# Altium schematic sheet fpga_config.SchDoc
size A4
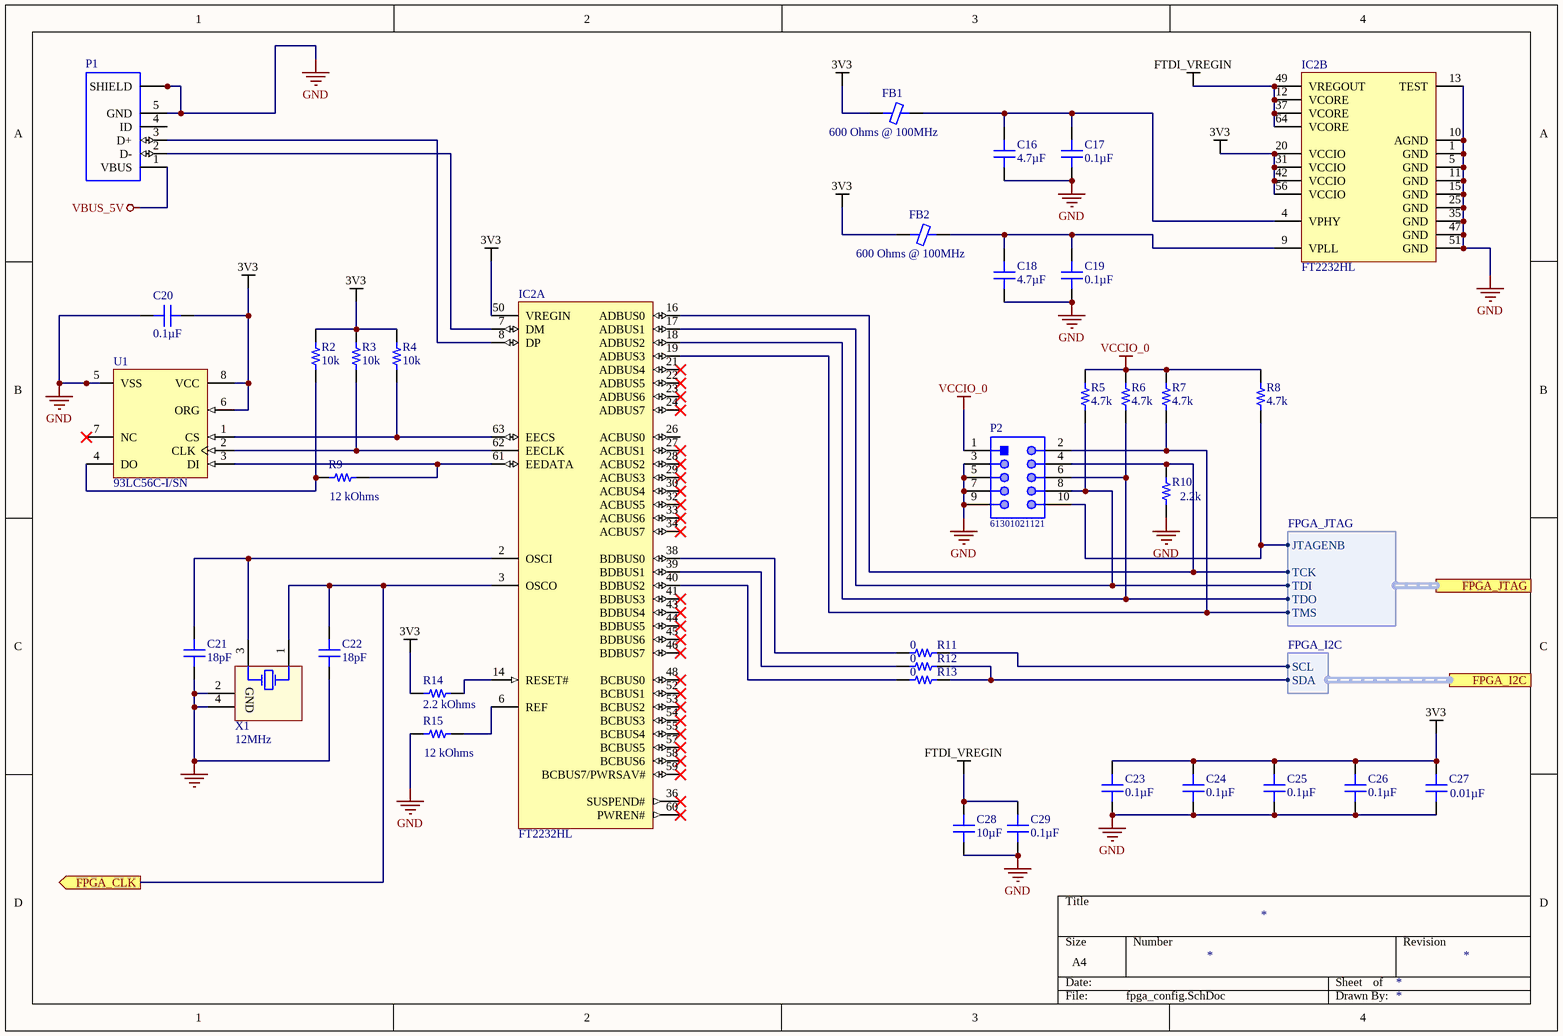
[diagram p0: fpga_config.SchDoc]

## Parts
C16  4.7µF  [CAP 0603_1608]
C17  0.1µF  [CAP 0603_1608]
C18  4.7µF  [CAP 0603_1608]
C19  0.1µF  [CAP 0603_1608]
C20  0.1µF  [CAP 0603_1608]
C21  18pF  [CAP 0603_1608]
C22  18pF  [CAP 0603_1608]
C23  0.1µF  [CAP 0603_1608]
C24  0.1µF  [CAP 0603_1608]
C25  0.1µF  [CAP 0603_1608]
C26  0.1µF  [CAP 0603_1608]
C27  0.01µF  [CAP 0603_1608]
C28  10µF  [CAP 0603_1608]
C29  0.1µF  [CAP 0603_1608]
FB1  600 Ohms @ 100MHz  [FER 0603_1608]
FB2  600 Ohms @ 100MHz  [FER 0603_1608]
IC2  FT2232HL  [FTDI-LQFP-64_L]  (parts A,B of 2)
P1  47346-0001  [MOLEX_47346-0001]  (value not drawn)
P2  61301021121  [61301021121]
R2  10k  [RES 0603_1608]
R3  10k  [RES 0603_1608]
R4  10k  [RES 0603_1608]
R5  4.7k  [RES 0603_1608]
R6  4.7k  [RES 0603_1608]
R7  4.7k  [RES 0603_1608]
R8  4.7k  [RES 0603_1608]
R9  12 kOhms  [RES 0603_1608]
R10  2.2k  [RES 0603_1608]
R11  0  [RES 0603_1608]
R12  0  [RES 0603_1608]
R13  0  [RES 0603_1608]
R14  2.2 kOhms  [RES 0603_1608]
R15  12 kOhms  [RES 0603_1608]
U1  93LC56C-I/SN  [SOIC-SN8_L]
X1  12MHz  [ABRA-ABMM2-4_V]

## Ports
FPGA_CLK (out), FPGA_I2C (harness FPGA_I2C), FPGA_JTAG (harness FPGA_JTAG)

## Harnesses
FPGA_JTAG: JTAGENB, TCK, TDI, TDO, TMS
FPGA_I2C: SCL, SDA

## Nets
3V3: C20.1 C23.2 C24.2 C25.2 C26.2 C27.2 FB1.1 FB2.1 IC2.20(VCCIO) IC2.31(VCCIO) IC2.42(VCCIO) IC2.50(VREGIN) IC2.56(VCCIO) R2.2 R3.2 R4.2 R14.1 U1.6(ORG) U1.8(VCC)
FTDI_VREGIN: C28.2 C29.2 IC2.12(VCORE) IC2.37(VCORE) IC2.49(VREGOUT) IC2.64(VCORE)
GND: C16.1 C17.1 C18.1 C19.1 C20.2 C21.1 C22.1 C23.1 C24.1 C25.1 C26.1 C27.1 C28.1 C29.1 IC2.1(GND) IC2.5(GND) IC2.10(AGND) IC2.11(GND) IC2.13(TEST) IC2.15(GND) IC2.25(GND) IC2.35(GND) IC2.47(GND) IC2.51(GND) P1.5(GND) P1.SH1(SHIELD) P1.SH2(SHIELD) P1.SH3(SHIELD) P1.SH4(SHIELD) P1.SH5(SHIELD) P1.SH6(SHIELD) P2.3 P2.5 P2.7 P2.9 R10.1 R15.1 U1.5(VSS) X1.2(GND) X1.4(GND)
VBUS_5V: P1.1(VBUS)
VCCIO_0: P2.1 R5.2 R6.2 R7.2 R8.2
FPGA_CLK: C22.2 IC2.3(OSCO) X1.1(X1) ; port FPGA_CLK
NetC16_2: C16.2 C17.2 FB1.2 IC2.4(VPHY)
NetC18_2: C18.2 C19.2 FB2.2 IC2.9(VPLL)
NetC21_2: C21.2 IC2.2(OSCI) X1.3(X2)
NetIC2_6: IC2.6(REF) R15.2
NetIC2_7: IC2.7(DM) P1.2(D-)
NetIC2_8: IC2.8(DP) P1.3(D+)
NetIC2_14: IC2.14(RESET#) R14.2
NetIC2_16: IC2.16(ADBUS0) P2.4 R10.2 ; port FPGA_JTAG.TCK
NetIC2_17: IC2.17(ADBUS1) P2.8 R5.1 ; port FPGA_JTAG.TDI
NetIC2_18: IC2.18(ADBUS2) P2.6 R6.1 ; port FPGA_JTAG.TDO
NetIC2_19: IC2.19(ADBUS3) P2.2 R7.1 ; port FPGA_JTAG.TMS
NetIC2_38: IC2.38(BDBUS0) R11.1
NetIC2_39: IC2.39(BDBUS1) R12.1
NetIC2_40: IC2.40(BDBUS2) R13.1
NetIC2_61: IC2.61(EEDATA) R9.2 U1.3(DI)
NetIC2_62: IC2.62(EECLK) R3.1 U1.2(CLK)
NetIC2_63: IC2.63(EECS) R4.1 U1.1(CS)
NetP2_10: P2.10 R8.1 ; port FPGA_JTAG.JTAGENB
NetR2_1: R2.1 R9.1 U1.4(DO)
NetR11_2: R11.2 ; port FPGA_I2C.SCL
NetR12_2: R12.2 R13.2 ; port FPGA_I2C.SDA

Not connected (* = marked no-connect by the designer): IC2 21(ADBUS4)* 22(ADBUS5)* 23(ADBUS6)* 24(ADBUS7)* 26(ACBUS0) 27(ACBUS1)* 28(ACBUS2)* 29(ACBUS3)* 30(ACBUS4)* 32(ACBUS5)* 33(ACBUS6)* 34(ACBUS7)* 36(SUSPEND#)* 41(BDBUS3)* 43(BDBUS4)* 44(BDBUS5)* 45(BDBUS6)* 46(BDBUS7)* 48(BCBUS0)* 52(BCBUS1)* 53(BCBUS2)* 54(BCBUS3)* 55(BCBUS4)* 57(BCBUS5)* 58(BCBUS6)* 59(BCBUS7/PWRSAV#)* 60(PWREN#)*; P1 4(ID); U1 7(NC)*

## Library data of the parts
C16 C18 = LMK107BJ475KA-T: CAP CER 4.7UF 10V X5R 0603; Manufacturer: Taiyo Yuden; Tolerance: ±10%; Part Number: LMK107BJ475KA-T; Value: 4.7µF; Applications: General Purpose; Capacitance: 4.7µF; ComponentLink1Description: Datasheet; ComponentLink1URL: https://ds.yuden.co.jp/TYCOMPAS/ut/detail?pn=LMK107BJ475KA-T  &u=M; ComponentLink2Description: DigiKey Link; ComponentLink2URL: http://digikey.com/product-detail/en/taiyo-yuden/LMK107BJ475KA-T/587-1441-1-ND/1004072; Device Package: 0603 (1608 Metric); LastUpdated: 02.09.2020 1:03:36; Lifecycle Status: Active; Minimum Order: 1; Mounting Type: Surface Mount, MLCC; Operating Temperature: -55°C ~ 85°C; Package / Case: 0603 (1608 Metric); Packaging: TapeAndReel; PartId: 2244; Part Status: Active; Price: 0.03; Series: M; Size / Dimension: 0.063" L x 0.031" W (1.60mm x 0.80mm); Supplier 1: DigiKey; Supplier Part Number 1: 587-1441-1-ND; Temperature Coefficient: X5R; Thickness (Max): 0.035" (0.90mm); Voltage - Rated: 10V
C17 C19 C20 C23-C26 C29 = C0603C104K5RAC7411: CAP CER 0.1UF 50V X7R 0603; Manufacturer: KEMET; Tolerance: ±10%; Part Number: C0603C104K5RAC7411; Value: 0.1µF; Applications: Bypass, Decoupling; Capacitance: 0.1µF; ComponentLink1Description: Datasheet; ComponentLink1URL: https://api.kemet.com/component-edge/download/datasheet/C0603C104K5RAC7411.pdf; ComponentLink2Description: DigiKey Link; ComponentLink2URL: http://digikey.com/product-detail/en/kemet/C0603C104K5RAC7411/399-7374-2-ND/3317013; Device Package: 0603 (1608 Metric); LastUpdated: 02.09.2020 1:03:36; Lifecycle Status: Active; Minimum Order: 15000; Mounting Type: Surface Mount, MLCC; Operating Temperature: -55°C ~ 125°C; Package / Case: 0603 (1608 Metric); Packaging: TapeAndReel; PartId: 2233; Part Status: Active; Price: 0.02; Series: SMD Comm X7R; Size / Dimension: 0.063" L x 0.031" W (1.60mm x 0.80mm); Supplier 1: DigiKey; Supplier Part Number 1: 399-7374-2-ND; Temperature Coefficient: X7R; Thickness (Max): 0.035" (0.90mm); Voltage - Rated: 50V
C21 C22 = VJ0603A180FXQCW1BC: CAP CER 18PF 10V C0G/NP0 0603; Manufacturer: Vishay Vitramon; Temperature Coefficient: C0G, NP0; Tolerance: ±1%; Part Number: VJ0603A180FXQCW1BC; Value: 18pF; Applications: General Purpose; Capacitance: 18pF; ComponentLink1Description: Datasheet; ComponentLink1URL: https://www.vishay.com/docs/28548/vjw1bcbascomseries.pdf; ComponentLink2Description: DigiKey Link; ComponentLink2URL: http://digikey.com/product-detail/en/vishay-vitramon/VJ0603A180FXQCW1BC/720-1660-1-ND/8324080; Device Package: 0603 (1608 Metric); LastUpdated: 02.09.2020 1:03:27; Lifecycle Status: Active; Minimum Order: 1; Mounting Type: Surface Mount, MLCC; Operating Temperature: -55°C ~ 125°C; Package / Case: 0603 (1608 Metric); Packaging: TapeAndReel; PartId: 7094; Part Status: Active; Price: 0.04; Series: VJ; Size / Dimension: 0.063" L x 0.031" W (1.60mm x 0.80mm); Supplier 1: DigiKey; Supplier Part Number 1: 720-1660-1-ND; Thickness (Max): 0.034" (0.87mm); Voltage - Rated: 10V
C27 = C0603C103KARACAUTO: CAP CER 0.01UF 250V X7R 0603; Manufacturer: KEMET; Tolerance: ±10%; Part Number: C0603C103KARACAUTO; Value: 0.01µF; Applications: Automotive, Bypass, Decoupling; Capacitance: 0.01µF; ComponentLink1Description: Datasheet; ComponentLink1URL: https://api.kemet.com/component-edge/download/datasheet/C0603C103KARACAUTO.pdf; ComponentLink2Description: DigiKey Link; ComponentLink2URL: http://digikey.com/product-detail/en/kemet/C0603C103KARACAUTO/399-17960-1-ND/9084030; Device Package: 0603 (1608 Metric); LastUpdated: 02.09.2020 1:03:10; Lifecycle Status: Active; Minimum Order: 1; Mounting Type: Surface Mount, MLCC; Operating Temperature: -55°C ~ 125°C; Package / Case: 0603 (1608 Metric); Packaging: TapeAndReel; PartId: 15195; Part Status: Active; Price: 0.25; Ratings: AEC-Q200; Series: SMD Auto X7R; Size / Dimension: 0.063" L x 0.031" W (1.60mm x 0.80mm); Supplier 1: DigiKey; Supplier Part Number 1: 399-17960-1-ND; Temperature Coefficient: X7R; Thickness (Max): 0.034" (0.87mm); Voltage - Rated: 250V
C28 = GRM188R60J106ME47D: CAP CER 10UF 6.3V X5R 0603; Manufacturer: Murata Electronics; Tolerance: ±20%; Part Number: GRM188R60J106ME47D; Value: 10µF; Applications: General Purpose; Capacitance: 10µF; ComponentLink1Description: Datasheet; ComponentLink1URL: https://www.murata.com/~/media/webrenewal/support/library/catalog/products/capacitor/mlcc/c02e.ashx?la=en-us; ComponentLink2Description: DigiKey Link; ComponentLink2URL: http://digikey.com/product-detail/en/murata-electronics/GRM188R60J106ME47D/490-3896-1-ND/965938; Device Package: 0603 (1608 Metric); LastUpdated: 02.09.2020 1:03:35; Lifecycle Status: Active; Minimum Order: 1; Mounting Type: Surface Mount, MLCC; Operating Temperature: -55°C ~ 85°C; Package / Case: 0603 (1608 Metric); Packaging: TapeAndReel; PartId: 2351; Part Status: Active; Price: 0.03; Series: GRM; Size / Dimension: 0.063" L x 0.031" W (1.60mm x 0.80mm); Supplier 1: DigiKey; Supplier Part Number 1: 490-3896-1-ND; Temperature Coefficient: X5R; Thickness (Max): 0.035" (0.90mm); Voltage - Rated: 6.3V
FB1 FB2 = BLM18AG601SN1D: FERRITE BEAD 600 OHM 0603 1LN; Manufacturer: Murata Electronics; Current Rating (Max): 500mA; DC Resistance (DCR) (Max): 380mOhm; Number of Lines: 1; Part Number: BLM18AG601SN1D; ComponentLink1Description: Datasheet; ComponentLink1URL: https://www.murata.com/en-us/products/productdata/8796738650142/ENFA0003.pdf; ComponentLink2Description: DigiKey Link; ComponentLink2URL: http://digikey.com/product-detail/en/murata-electronics/BLM18AG601SN1D/490-1014-1-ND/584462; Device Package: 0603 (1608 Metric); Height (Max): 0.037" (0.95mm); Impedance @ Frequency: 600 Ohms @ 100MHz; LastUpdated: 02.09.2020 1:18:18; Lifecycle Status: Active; Minimum Order: 1; Mounting Type: Surface Mount; Operating Temperature: -55°C ~ 125°C; Package / Case: 0603 (1608 Metric); Packaging: TapeAndReel; PartId: 848; Part Status: Active; Price: 0.02; Series: EMIFIL®, BLM18; Size / Dimension: 0.063" L x 0.032" W (1.60mm x 0.80mm); Supplier 1: DigiKey; Supplier Part Number 1: 490-1014-1-ND; Value: 600 Ohms @ 100MHz
IC2 = CMP-2000-06287-1: Dual High Speed USB to Multipurpose UART / FIFO IC / , 3 to 3.6 V, -40 to 85 degC, 64- Pin LQFP, RoHS; Manufacturer: FTDI; Number of Channels per Chip: 2; Standard Supported: RS232,RS422,RS485; Maximum Data Rate: 480Mbit/s; Package Description: 64-Pin Low-profile Quad Flat Package, Body 10 x 10 mm, Pitch 0.5 mm; Maximum Operating Temperature: +85°C; Mounting Technology: SurfaceMount; Pin Count: 64; Package Reference: LQFP-64; Manufacturer URL: http://www.nxp.com/; Length: 10mm; Width: 10mm; Minimum Operating Temperature: -40°C; Dimensions: 10x10x1.4mm; Package Type: LQFP; Mounting Type: SurfaceMount; Datasheet URL: http://www.ftdichip.com/Support/Documents/DataSheets/ICs/DS_FT2232H.pdf; Datasheet Version: Rev. 2.5, 07/2016; Height: 1.4mm
P1 = 47346-0001: CONN RCPT 5POS MICRO USB R/A  SMD; Value: *; Supplier 1: Farnell; Supplier Part Number 1: 1568026; Supplier 2: Mouser; Supplier Part Number 2: 538-47346-0001
P2 = CMP-1502-01084-1: THT Vertical Pin Header WR-PHD, Pitch 2.54 mm, Dual Row, 10 pins; Manufacturer: Wurth Elektronik; Working Voltage: 250VAC; Pitch: 2.54mm; Contact Resistance: 20mOhm; Gender: Male; Rated Current: 3A; Withstanding Voltage: 500VAC; Pin Number: 10; Operating Temperature: -40to105degC; Mounting Technology: THT; Publisher: WurthElektronik; Manufacturer URL: http://www.we-online.de; Part Number: 61301021121; Row Number: Dual; Packaging: Bag; Orientation: Vertical; Package Reference: 61301021121; Datasheet URL: https://katalog.we-online.de/em/datasheet/6130xx21121.pdf
R2-R4 = RNCS0603BKE10K0: RES 10K OHM 0.1% 1/16W 0603; Manufacturer: Stackpole Electronics Inc; Power (Watts): 0.063W, 1/16W; Resistance: 10 kOhms; Temperature Coefficient: ±25ppm/°C; Part Number: RNCS0603BKE10K0; Value: 10k; ComponentLink1Description: Datasheet; ComponentLink1URL: https://www.seielect.com/catalog/sei-rncs_rnch.pdf; ComponentLink2Description: DigiKey Link; ComponentLink2URL: http://digikey.com/product-detail/en/stackpole-electronics-inc/RNCS0603BKE10K0/RNCS0603BKE10K0CT-ND/1800113; Composition: Thin Film; Device Package: 0603 (1608 Metric); Features: Anti-Corrosive, Automotive AEC-Q200, Moisture Resistant; Height - Seated (Max): 0.022" (0.55mm); LastUpdated: 02.09.2020 1:10:25; Lifecycle Status: Active; Minimum Order: 1; Number of Terminations: 2; Operating Temperature: -55°C ~ 155°C; Package / Case: 0603 (1608 Metric); Packaging: TapeAndReel; PartId: 4838; Part Status: Active; Price: 0.08; Ratings: AEC-Q200; Series: RNCS; Size / Dimension: 0.061" L x 0.031" W (1.55mm x 0.80mm); Supplier 1: DigiKey; Supplier Part Number 1: RNCS0603BKE10K0CT-ND; Supplier Device Package: 0603; Tolerance: ±0.1%
R5-R8 = RT0603FRE074K7L: RES SMD 4.7K OHM 1% 1/10W 0603; Manufacturer: Yageo; Power (Watts): 0.1W, 1/10W; Resistance: 4.7 kOhms; Temperature Coefficient: ±50ppm/°C; Part Number: RT0603FRE074K7L; Value: 4.7k; ComponentLink1Description: Datasheet; ComponentLink1URL: https://www.yageo.com/upload/media/product/productsearch/datasheet/rchip/PYu-RT_1-to-0.01_RoHS_L_11.pdf; ComponentLink2Description: DigiKey Link; ComponentLink2URL: http://digikey.com/product-detail/en/yageo/RT0603FRE074K7L/YAG1238CT-ND/4340591; Composition: Thin Film; Device Package: 0603 (1608 Metric); Height - Seated (Max): 0.022" (0.55mm); LastUpdated: 02.09.2020 1:10:23; Lifecycle Status: Active; Minimum Order: 1; Number of Terminations: 2; Operating Temperature: -55°C ~ 155°C; Package / Case: 0603 (1608 Metric); Packaging: TapeAndReel; PartId: 5678; Part Status: Active; Price: 0.01; Series: RT; Size / Dimension: 0.063" L x 0.031" W (1.60mm x 0.80mm); Supplier 1: DigiKey; Supplier Part Number 1: YAG1238CT-ND; Supplier Device Package: 0603; Tolerance: ±1%
R9 R15 = RMCF0603JT12K0: RES 12K OHM 5% 1/10W 0603; Manufacturer: Stackpole Electronics Inc; Power (Watts): 0.1W, 1/10W; Temperature Coefficient: ±200ppm/°C; Part Number: RMCF0603JT12K0; Value: 12 kOhms; ComponentLink1Description: Datasheet; ComponentLink1URL: https://www.seielect.com/catalog/sei-rmcf_rmcp.pdf; ComponentLink2Description: DigiKey Link; ComponentLink2URL: http://digikey.com/product-detail/en/stackpole-electronics-inc/RMCF0603JT12K0/RMCF0603JT12K0CT-ND/1943192; Composition: Thick Film; Device Package: 0603 (1608 Metric); Features: Automotive AEC-Q200; Height - Seated (Max): 0.022" (0.55mm); LastUpdated: 02.09.2020 1:10:24; Lifecycle Status: Active; Minimum Order: 1; Number of Terminations: 2; Operating Temperature: -55°C ~ 155°C; Package / Case: 0603 (1608 Metric); Packaging: CutTape; PartId: 5166; Part Status: Active; Price: 0.10; Ratings: AEC-Q200; Resistance: 12 kOhms; Series: RMCF; Size / Dimension: 0.061" L x 0.031" W (1.55mm x 0.80mm); Supplier 1: DigiKey; Supplier Part Number 1: RMCF0603JT12K0CT-ND; Supplier Device Package: 0603; Tolerance: ±5%
R10 = ERA-3AEB222V: RES SMD 2.2K OHM 0.1% 1/10W 0603; Manufacturer: Panasonic Electronic Components; Power (Watts): 0.1W, 1/10W; Resistance: 2.2 kOhms; Temperature Coefficient: ±25ppm/°C; Part Number: ERA-3AEB222V; Value: 2.2k; ComponentLink1Description: Datasheet; ComponentLink1URL: https://industrial.panasonic.com/cdbs/www-data/pdf/RDM0000/AOA0000C307.pdf; ComponentLink2Description: DigiKey Link; ComponentLink2URL: http://digikey.com/product-detail/en/panasonic-electronic-components/ERA-3AEB222V/P2.2KDBCT-ND/1466060; Composition: Thin Film; Device Package: 0603 (1608 Metric); Features: Automotive AEC-Q200; Height - Seated (Max): 0.022" (0.55mm); LastUpdated: 02.09.2020 1:10:23; Lifecycle Status: Active; Minimum Order: 1; Number of Terminations: 2; Operating Temperature: -55°C ~ 155°C; Package / Case: 0603 (1608 Metric); Packaging: TapeAndReel; PartId: 5547; Part Status: Active; Price: 0.04; Ratings: AEC-Q200; Series: ERA-3A; Size / Dimension: 0.063" L x 0.031" W (1.60mm x 0.80mm); Supplier 1: DigiKey; Supplier Part Number 1: P2.2KDBCT-ND; Supplier Device Package: 0603; Tolerance: ±0.1%
R11-R13 = TLRZ1JTTD: RES 0 OHM JUMPER 0603; Manufacturer: KOA Speer Electronics, Inc.; Part Number: TLRZ1JTTD; ComponentLink1Description: Datasheet; ComponentLink1URL: http://www.koaspeer.com/catimages/Products/TLRZ/TLRZ.pdf; ComponentLink2Description: DigiKey Link; ComponentLink2URL: http://digikey.com/product-detail/en/koa-speer-electronics-inc/TLRZ1JTTD/2019-TLRZ1JTTDCT-ND/9847537; Composition: Metal Element; Device Package: 0603 (1608 Metric); Features: Automotive AEC-Q200, Current Sense; Height - Seated (Max): 0.022" (0.55mm); LastUpdated: 02.09.2020 1:10:25; Lifecycle Status: Active; Minimum Order: 1; Number of Terminations: 2; Operating Temperature: -55°C ~ 170°C; Package / Case: 0603 (1608 Metric); Packaging: TapeAndReel; PartId: 4851; Part Status: Active; Price: 0.08; Ratings: AEC-Q200; Series: TLRZ; Size / Dimension: 0.063" L x 0.031" W (1.60mm x 0.80mm); Supplier 1: DigiKey; Supplier Part Number 1: 2019-TLRZ1JTTDCT-ND; Supplier Device Package: 0603; Tolerance: Jumper
R14 = ERA-3AEB222V: RES SMD 2.2K OHM 0.1% 1/10W 0603; Manufacturer: Panasonic Electronic Components; Power (Watts): 0.1W, 1/10W; Temperature Coefficient: ±25ppm/°C; Part Number: ERA-3AEB222V; Value: 2.2 kOhms; ComponentLink1Description: Datasheet; ComponentLink1URL: https://industrial.panasonic.com/cdbs/www-data/pdf/RDM0000/AOA0000C307.pdf; ComponentLink2Description: DigiKey Link; ComponentLink2URL: http://digikey.com/product-detail/en/panasonic-electronic-components/ERA-3AEB222V/P2.2KDBCT-ND/1466060; Composition: Thin Film; Device Package: 0603 (1608 Metric); Features: Automotive AEC-Q200; Height - Seated (Max): 0.022" (0.55mm); LastUpdated: 02.09.2020 1:10:23; Lifecycle Status: Active; Minimum Order: 1; Number of Terminations: 2; Operating Temperature: -55°C ~ 155°C; Package / Case: 0603 (1608 Metric); Packaging: TapeAndReel; PartId: 5547; Part Status: Active; Price: 0.04; Ratings: AEC-Q200; Resistance: 2.2 kOhms; Series: ERA-3A; Size / Dimension: 0.063" L x 0.031" W (1.60mm x 0.80mm); Supplier 1: DigiKey; Supplier Part Number 1: P2.2KDBCT-ND; Supplier Device Package: 0603; Tolerance: ±0.1%
U1 = CMP-0162-00111-1: 2K, 256x8 or 128x16-bit, 2.5V Microwire Serial EEPROM, 8-Pin SOIC 150mil, Industrial Temperature; ComponentAvailability: Unknown. Contact manufacturer to determine status.; PackageReference: SOIC-SN8; PackageVersion: revBB, Aug-2009; Code_IPC: SOIC127P600-8; PackageDescription: 8-Lead Plastic Small Outline (SN) - Narrow, 3.90mm Body [SOIC]; DatasheetVersion: revF, May-2008; Code_JEDEC: MS-012
X1 = CMP-0277-00003-1: Ceramic Surface Mount Low Profile Quartz Crystal, 8 MHz, -20 to 70 degC, 4-Pin 6 x 3.6 x 1.2 mm SMD, RoHS, 1000pcs / Reel; Manufacturer: Abracon; PartNumber: ABMM2-8.000MHZ-E2-T; ESR: 72 Ohm Max.; Frequency: 8 MHz; Shunt Capacitance C0: 7 pF Max.; Load Capacitance CL: 18 pF Typ.; ComponentLink3Description: Package Specification; PackageDescription: 4-Pin SMD, Body 6 x 3.6 mm, Pitch 4.4 mm; DatasheetVersion: Jan-13; ComponentLink1URL: http://www.abracon.com/; ComponentLink2URL: http://www.abracon.com/Resonators/ABMM2.pdf; Temperature Range: -20 to 70 degC; Mounting Technology: Surface Mount; RoHS: TRUE; ComponentLink2Description: Datasheet; ComponentLink3URL: http://www.abracon.com/Resonators/ABMM2.pdf; ComponentLink1Description: Manufacturer URL; Packing: 1000pcs / Reel